# Altium schematic sheet 08 RAM.SchDoc
size 420 x 297 mm; Address1: Address1; Address2: Address2; Address3: Address3; Address4: Address4; DocumentNumber: АБВГ.123456.001 Э3; SheetNumber: 8; SheetTotal: 23; Scale: 1:1; DocumentType: Схема электрическая принципиальная; FirstReferrence: АБВГ.123456.001
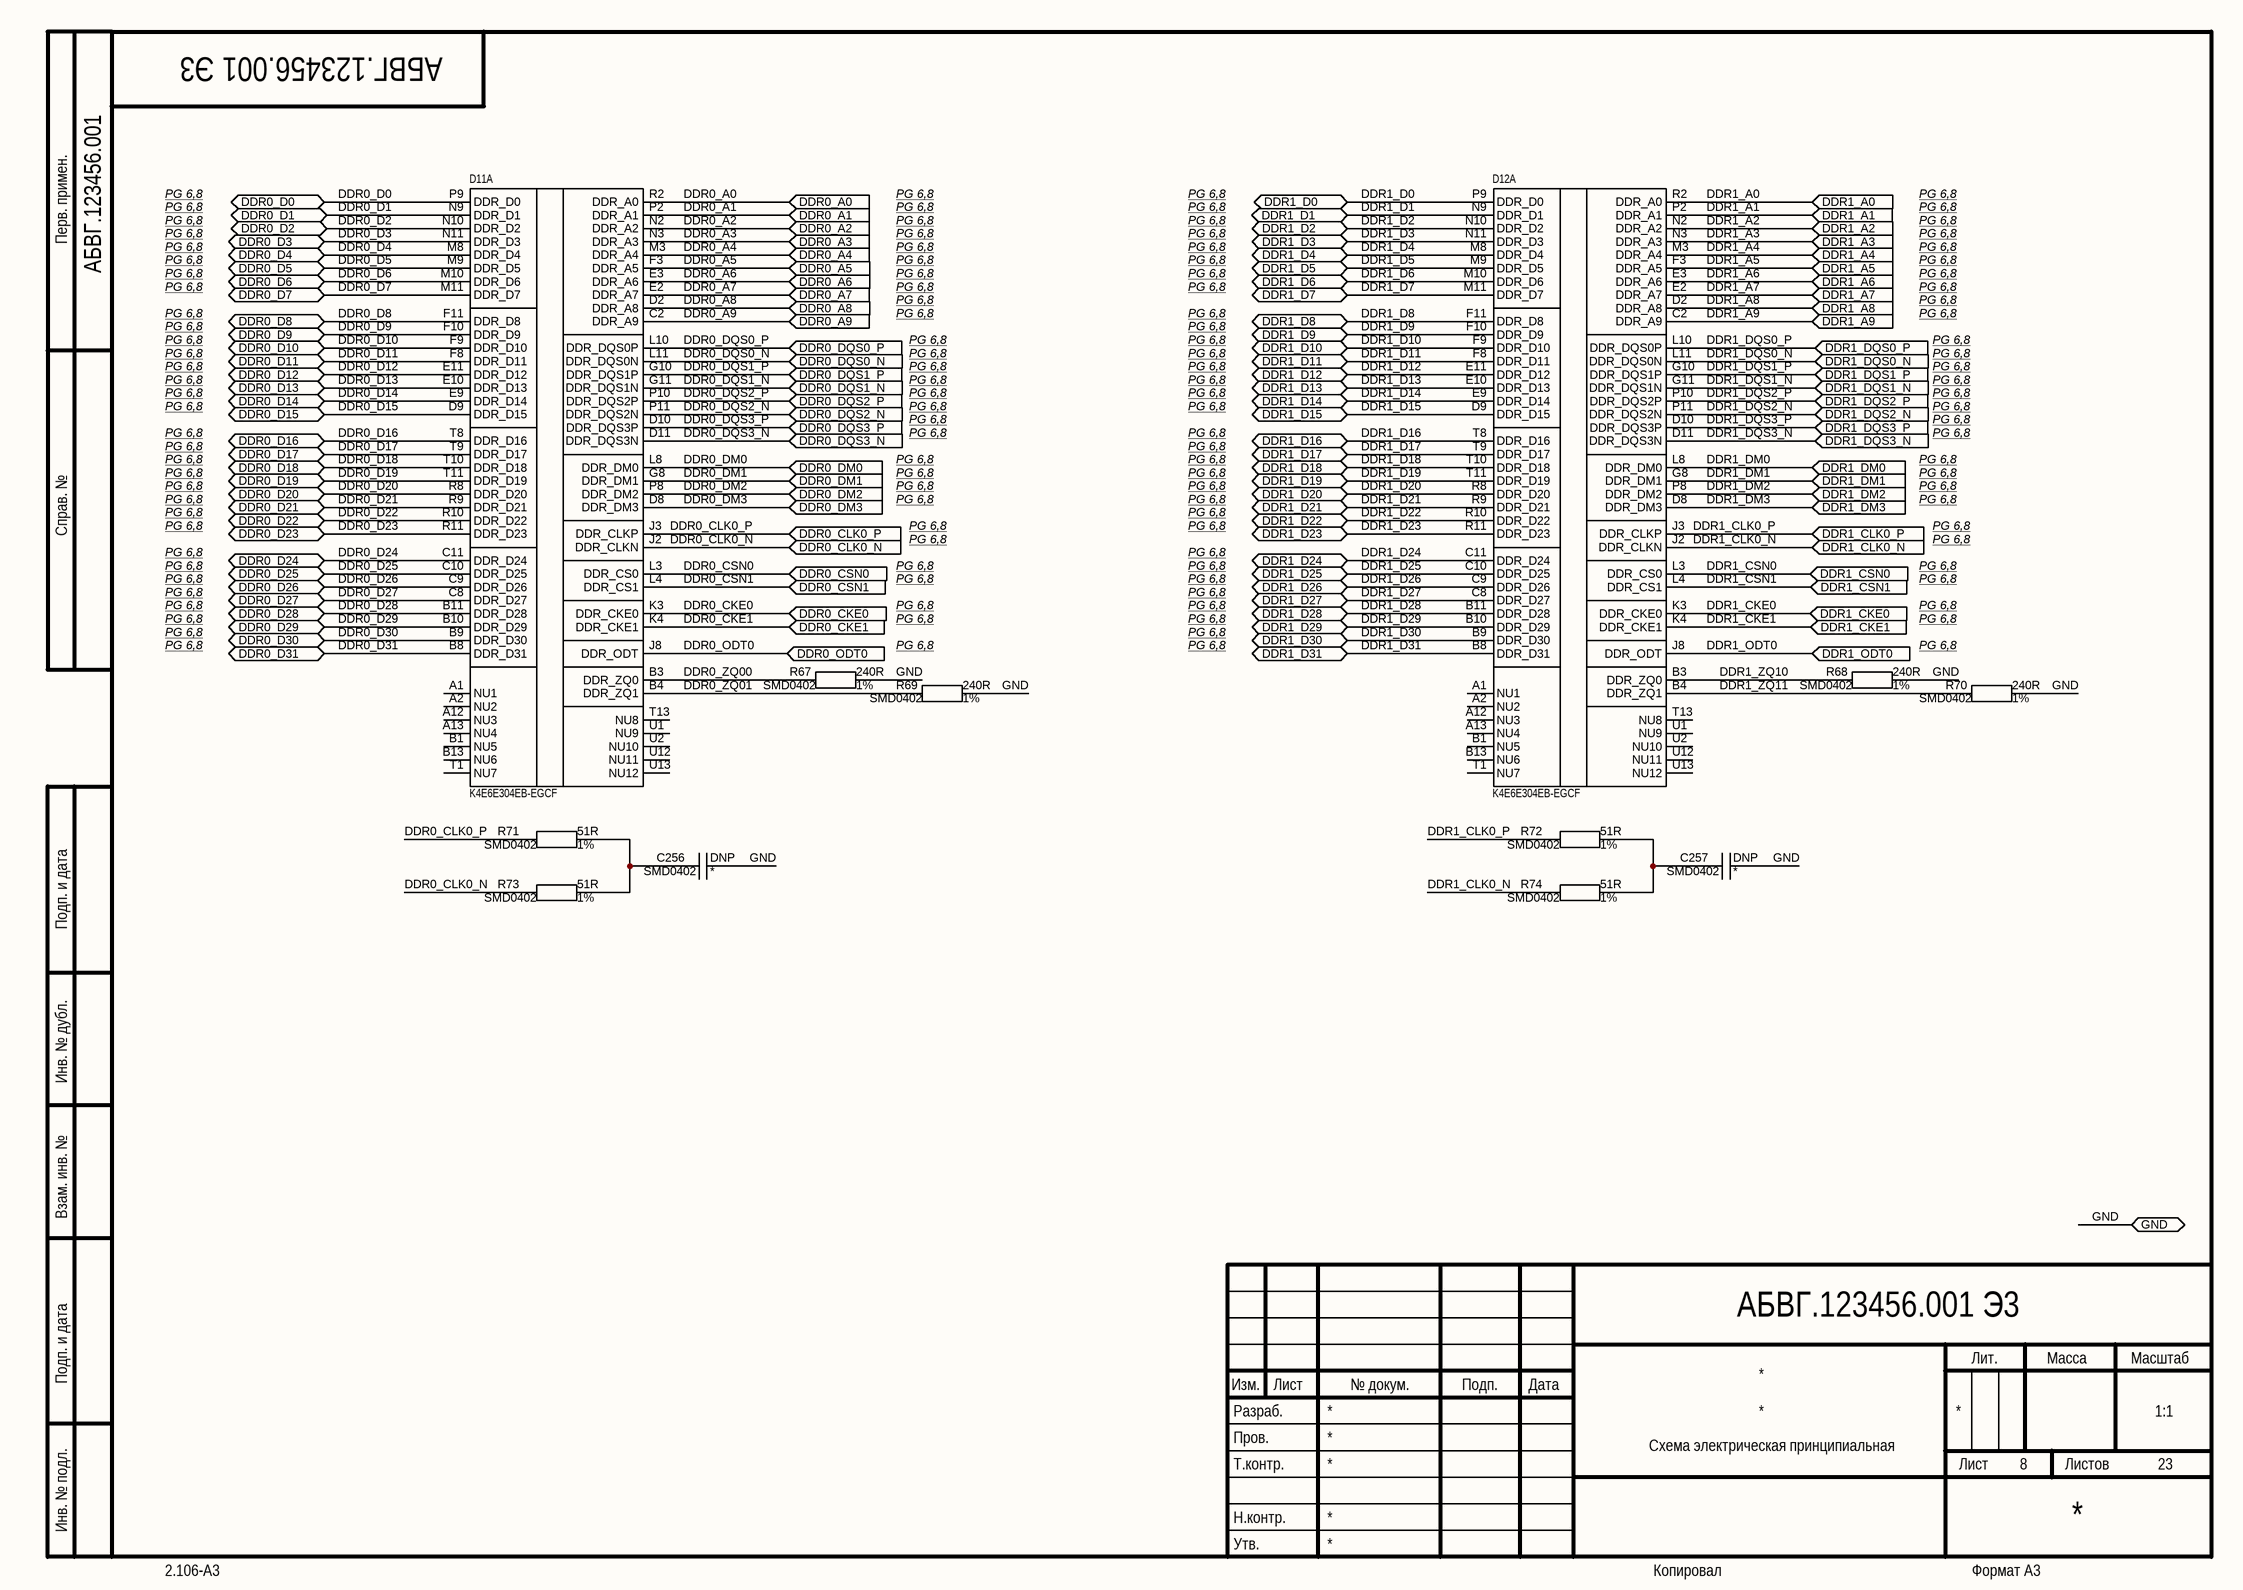
[diagram p0: 08 RAM.SchDoc]

## Parts
C256  Package: SMD0402  [CAP_SMD_0402_small]  (hidden comment: DNP)
C257  Package: SMD0402  [CAP_SMD_0402_small]  (hidden comment: DNP)
D11  K4E6E304EB-EGCF  [FBGA178_13R00X11R50X1R20]  (part A of 2)
D12  K4E6E304EB-EGCF  [FBGA178_13R00X11R50X1R20]  (part A of 2)
R67  Package: SMD0402  Tolerance: 1%  [RES_SMD_0402_SMALL]  (hidden comment: 240R)
R68  Package: SMD0402  Tolerance: 1%  [RES_SMD_0402_SMALL]  (hidden comment: 240R)
R69  Package: SMD0402  Tolerance: 1%  [RES_SMD_0402_SMALL]  (hidden comment: 240R)
R70  Package: SMD0402  Tolerance: 1%  [RES_SMD_0402_SMALL]  (hidden comment: 240R)
R71  Package: SMD0402  Tolerance: 1%  [RES_SMD_0402_SMALL]  (hidden comment: 51R)
R72  Package: SMD0402  Tolerance: 1%  [RES_SMD_0402_SMALL]  (hidden comment: 51R)
R73  Package: SMD0402  Tolerance: 1%  [RES_SMD_0402_SMALL]  (hidden comment: 51R)
R74  Package: SMD0402  Tolerance: 1%  [RES_SMD_0402_SMALL]  (hidden comment: 51R)

## Ports
DDR0_A0 (in), DDR0_A1 (in), DDR0_A2 (in), DDR0_A3 (in), DDR0_A4 (in), DDR0_A5 (in), DDR0_A6 (in), DDR0_A7 (in), DDR0_A8 (in), DDR0_A9 (in), DDR0_CKE0 (in), DDR0_CKE1 (in), DDR0_CLK0_N (in), DDR0_CLK0_P (in), DDR0_CSN0 (in), DDR0_CSN1 (in), DDR0_D0 (bidir), DDR0_D1 (bidir), DDR0_D2 (bidir), DDR0_D3 (bidir), DDR0_D4 (bidir), DDR0_D5 (bidir), DDR0_D6 (bidir), DDR0_D7 (bidir), DDR0_D8 (bidir), DDR0_D9 (bidir), DDR0_D10 (bidir), DDR0_D11 (bidir), DDR0_D12 (bidir), DDR0_D13 (bidir), DDR0_D14 (bidir), DDR0_D15 (bidir), DDR0_D16 (bidir), DDR0_D17 (bidir), DDR0_D18 (bidir), DDR0_D19 (bidir), DDR0_D20 (bidir), DDR0_D21 (bidir), DDR0_D22 (bidir), DDR0_D23 (bidir), DDR0_D24 (bidir), DDR0_D25 (bidir), DDR0_D26 (bidir), DDR0_D27 (bidir), DDR0_D28 (bidir), DDR0_D29 (bidir), DDR0_D30 (bidir), DDR0_D31 (bidir), DDR0_DM0 (in), DDR0_DM1 (in), DDR0_DM2 (in), DDR0_DM3 (in), DDR0_DQS0_N (in), DDR0_DQS0_P (in), DDR0_DQS1_N (in), DDR0_DQS1_P (in), DDR0_DQS2_N (in), DDR0_DQS2_P (in), DDR0_DQS3_N (in), DDR0_DQS3_P (in), DDR0_ODT0 (in), DDR1_A0 (in), DDR1_A1 (in), DDR1_A2 (in), DDR1_A3 (in), DDR1_A4 (in), DDR1_A5 (in), DDR1_A6 (in), DDR1_A7 (in), DDR1_A8 (in), DDR1_A9 (in), DDR1_CKE0 (in), DDR1_CKE1 (in), DDR1_CLK0_N (in), DDR1_CLK0_P (in), DDR1_CSN0 (in), DDR1_CSN1 (in), DDR1_D0 (bidir), DDR1_D1 (bidir), DDR1_D2 (bidir), DDR1_D3 (bidir), DDR1_D4 (bidir), DDR1_D5 (bidir), DDR1_D6 (bidir), DDR1_D7 (bidir), DDR1_D8 (bidir), DDR1_D9 (bidir), DDR1_D10 (bidir), DDR1_D11 (bidir), DDR1_D12 (bidir), DDR1_D13 (bidir), DDR1_D14 (bidir), DDR1_D15 (bidir), DDR1_D16 (bidir), DDR1_D17 (bidir), DDR1_D18 (bidir), DDR1_D19 (bidir), DDR1_D20 (bidir), DDR1_D21 (bidir), DDR1_D22 (bidir), DDR1_D23 (bidir), DDR1_D24 (bidir), DDR1_D25 (bidir), DDR1_D26 (bidir), DDR1_D27 (bidir), DDR1_D28 (bidir), DDR1_D29 (bidir), DDR1_D30 (bidir), DDR1_D31 (bidir), DDR1_DM0 (in), DDR1_DM1 (in), DDR1_DM2 (in), DDR1_DM3 (in), DDR1_DQS0_N (in), DDR1_DQS0_P (in), DDR1_DQS1_N (in), DDR1_DQS1_P (in), DDR1_DQS2_N (in), DDR1_DQS2_P (in), DDR1_DQS3_N (in), DDR1_DQS3_P (in), DDR1_ODT0 (in), GND (bidir)

## Nets
DDR0_A0: D11.R2(DDR_A0) ; port DDR0_A0
DDR0_A1: D11.P2(DDR_A1) ; port DDR0_A1
DDR0_A2: D11.N2(DDR_A2) ; port DDR0_A2
DDR0_A3: D11.N3(DDR_A3) ; port DDR0_A3
DDR0_A4: D11.M3(DDR_A4) ; port DDR0_A4
DDR0_A5: D11.F3(DDR_A5) ; port DDR0_A5
DDR0_A6: D11.E3(DDR_A6) ; port DDR0_A6
DDR0_A7: D11.E2(DDR_A7) ; port DDR0_A7
DDR0_A8: D11.D2(DDR_A8) ; port DDR0_A8
DDR0_A9: D11.C2(DDR_A9) ; port DDR0_A9
DDR0_CKE0: D11.K3(DDR_CKE0) ; port DDR0_CKE0
DDR0_CKE1: D11.K4(DDR_CKE1) ; port DDR0_CKE1
DDR0_CLK0_N: D11.J2(DDR_CLKN) R73.2 ; port DDR0_CLK0_N
DDR0_CLK0_P: D11.J3(DDR_CLKP) R71.2 ; port DDR0_CLK0_P
DDR0_CSN0: D11.L3(DDR_CS0) ; port DDR0_CSN0
DDR0_CSN1: D11.L4(DDR_CS1) ; port DDR0_CSN1
DDR0_D0: D11.P9(DDR_D0) ; port DDR0_D0
DDR0_D1: D11.N9(DDR_D1) ; port DDR0_D1
DDR0_D2: D11.N10(DDR_D2) ; port DDR0_D2
DDR0_D3: D11.N11(DDR_D3) ; port DDR0_D3
DDR0_D4: D11.M8(DDR_D4) ; port DDR0_D4
DDR0_D5: D11.M9(DDR_D5) ; port DDR0_D5
DDR0_D6: D11.M10(DDR_D6) ; port DDR0_D6
DDR0_D7: D11.M11(DDR_D7) ; port DDR0_D7
DDR0_D8: D11.F11(DDR_D8) ; port DDR0_D8
DDR0_D9: D11.F10(DDR_D9) ; port DDR0_D9
DDR0_D10: D11.F9(DDR_D10) ; port DDR0_D10
DDR0_D11: D11.F8(DDR_D11) ; port DDR0_D11
DDR0_D12: D11.E11(DDR_D12) ; port DDR0_D12
DDR0_D13: D11.E10(DDR_D13) ; port DDR0_D13
DDR0_D14: D11.E9(DDR_D14) ; port DDR0_D14
DDR0_D15: D11.D9(DDR_D15) ; port DDR0_D15
DDR0_D16: D11.T8(DDR_D16) ; port DDR0_D16
DDR0_D17: D11.T9(DDR_D17) ; port DDR0_D17
DDR0_D18: D11.T10(DDR_D18) ; port DDR0_D18
DDR0_D19: D11.T11(DDR_D19) ; port DDR0_D19
DDR0_D20: D11.R8(DDR_D20) ; port DDR0_D20
DDR0_D21: D11.R9(DDR_D21) ; port DDR0_D21
DDR0_D22: D11.R10(DDR_D22) ; port DDR0_D22
DDR0_D23: D11.R11(DDR_D23) ; port DDR0_D23
DDR0_D24: D11.C11(DDR_D24) ; port DDR0_D24
DDR0_D25: D11.C10(DDR_D25) ; port DDR0_D25
DDR0_D26: D11.C9(DDR_D26) ; port DDR0_D26
DDR0_D27: D11.C8(DDR_D27) ; port DDR0_D27
DDR0_D28: D11.B11(DDR_D28) ; port DDR0_D28
DDR0_D29: D11.B10(DDR_D29) ; port DDR0_D29
DDR0_D30: D11.B9(DDR_D30) ; port DDR0_D30
DDR0_D31: D11.B8(DDR_D31) ; port DDR0_D31
DDR0_DM0: D11.L8(DDR_DM0) ; port DDR0_DM0
DDR0_DM1: D11.G8(DDR_DM1) ; port DDR0_DM1
DDR0_DM2: D11.P8(DDR_DM2) ; port DDR0_DM2
DDR0_DM3: D11.D8(DDR_DM3) ; port DDR0_DM3
DDR0_DQS0_N: D11.L11(DDR_DQS0N) ; port DDR0_DQS0_N
DDR0_DQS0_P: D11.L10(DDR_DQS0P) ; port DDR0_DQS0_P
DDR0_DQS1_N: D11.G11(DDR_DQS1N) ; port DDR0_DQS1_N
DDR0_DQS1_P: D11.G10(DDR_DQS1P) ; port DDR0_DQS1_P
DDR0_DQS2_N: D11.P11(DDR_DQS2N) ; port DDR0_DQS2_N
DDR0_DQS2_P: D11.P10(DDR_DQS2P) ; port DDR0_DQS2_P
DDR0_DQS3_N: D11.D11(DDR_DQS3N) ; port DDR0_DQS3_N
DDR0_DQS3_P: D11.D10(DDR_DQS3P) ; port DDR0_DQS3_P
DDR0_ODT0: D11.J8(DDR_ODT) ; port DDR0_ODT0
DDR0_ZQ00: D11.B3(DDR_ZQ0) R67.2
DDR0_ZQ01: D11.B4(DDR_ZQ1) R69.2
DDR1_A0: D12.R2(DDR_A0) ; port DDR1_A0
DDR1_A1: D12.P2(DDR_A1) ; port DDR1_A1
DDR1_A2: D12.N2(DDR_A2) ; port DDR1_A2
DDR1_A3: D12.N3(DDR_A3) ; port DDR1_A3
DDR1_A4: D12.M3(DDR_A4) ; port DDR1_A4
DDR1_A5: D12.F3(DDR_A5) ; port DDR1_A5
DDR1_A6: D12.E3(DDR_A6) ; port DDR1_A6
DDR1_A7: D12.E2(DDR_A7) ; port DDR1_A7
DDR1_A8: D12.D2(DDR_A8) ; port DDR1_A8
DDR1_A9: D12.C2(DDR_A9) ; port DDR1_A9
DDR1_CKE0: D12.K3(DDR_CKE0) ; port DDR1_CKE0
DDR1_CKE1: D12.K4(DDR_CKE1) ; port DDR1_CKE1
DDR1_CLK0_N: D12.J2(DDR_CLKN) R74.2 ; port DDR1_CLK0_N
DDR1_CLK0_P: D12.J3(DDR_CLKP) R72.2 ; port DDR1_CLK0_P
DDR1_CSN0: D12.L3(DDR_CS0) ; port DDR1_CSN0
DDR1_CSN1: D12.L4(DDR_CS1) ; port DDR1_CSN1
DDR1_D0: D12.P9(DDR_D0) ; port DDR1_D0
DDR1_D1: D12.N9(DDR_D1) ; port DDR1_D1
DDR1_D2: D12.N10(DDR_D2) ; port DDR1_D2
DDR1_D3: D12.N11(DDR_D3) ; port DDR1_D3
DDR1_D4: D12.M8(DDR_D4) ; port DDR1_D4
DDR1_D5: D12.M9(DDR_D5) ; port DDR1_D5
DDR1_D6: D12.M10(DDR_D6) ; port DDR1_D6
DDR1_D7: D12.M11(DDR_D7) ; port DDR1_D7
DDR1_D8: D12.F11(DDR_D8) ; port DDR1_D8
DDR1_D9: D12.F10(DDR_D9) ; port DDR1_D9
DDR1_D10: D12.F9(DDR_D10) ; port DDR1_D10
DDR1_D11: D12.F8(DDR_D11) ; port DDR1_D11
DDR1_D12: D12.E11(DDR_D12) ; port DDR1_D12
DDR1_D13: D12.E10(DDR_D13) ; port DDR1_D13
DDR1_D14: D12.E9(DDR_D14) ; port DDR1_D14
DDR1_D15: D12.D9(DDR_D15) ; port DDR1_D15
DDR1_D16: D12.T8(DDR_D16) ; port DDR1_D16
DDR1_D17: D12.T9(DDR_D17) ; port DDR1_D17
DDR1_D18: D12.T10(DDR_D18) ; port DDR1_D18
DDR1_D19: D12.T11(DDR_D19) ; port DDR1_D19
DDR1_D20: D12.R8(DDR_D20) ; port DDR1_D20
DDR1_D21: D12.R9(DDR_D21) ; port DDR1_D21
DDR1_D22: D12.R10(DDR_D22) ; port DDR1_D22
DDR1_D23: D12.R11(DDR_D23) ; port DDR1_D23
DDR1_D24: D12.C11(DDR_D24) ; port DDR1_D24
DDR1_D25: D12.C10(DDR_D25) ; port DDR1_D25
DDR1_D26: D12.C9(DDR_D26) ; port DDR1_D26
DDR1_D27: D12.C8(DDR_D27) ; port DDR1_D27
DDR1_D28: D12.B11(DDR_D28) ; port DDR1_D28
DDR1_D29: D12.B10(DDR_D29) ; port DDR1_D29
DDR1_D30: D12.B9(DDR_D30) ; port DDR1_D30
DDR1_D31: D12.B8(DDR_D31) ; port DDR1_D31
DDR1_DM0: D12.L8(DDR_DM0) ; port DDR1_DM0
DDR1_DM1: D12.G8(DDR_DM1) ; port DDR1_DM1
DDR1_DM2: D12.P8(DDR_DM2) ; port DDR1_DM2
DDR1_DM3: D12.D8(DDR_DM3) ; port DDR1_DM3
DDR1_DQS0_N: D12.L11(DDR_DQS0N) ; port DDR1_DQS0_N
DDR1_DQS0_P: D12.L10(DDR_DQS0P) ; port DDR1_DQS0_P
DDR1_DQS1_N: D12.G11(DDR_DQS1N) ; port DDR1_DQS1_N
DDR1_DQS1_P: D12.G10(DDR_DQS1P) ; port DDR1_DQS1_P
DDR1_DQS2_N: D12.P11(DDR_DQS2N) ; port DDR1_DQS2_N
DDR1_DQS2_P: D12.P10(DDR_DQS2P) ; port DDR1_DQS2_P
DDR1_DQS3_N: D12.D11(DDR_DQS3N) ; port DDR1_DQS3_N
DDR1_DQS3_P: D12.D10(DDR_DQS3P) ; port DDR1_DQS3_P
DDR1_ODT0: D12.J8(DDR_ODT) ; port DDR1_ODT0
DDR1_ZQ10: D12.B3(DDR_ZQ0) R68.2
DDR1_ZQ11: D12.B4(DDR_ZQ1) R70.2
GND: C256.1 C257.1 R67.1 R68.1 R69.1 R70.1 ; port GND
NetC256_2: C256.2 R71.1 R73.1
NetC257_2: C257.2 R72.1 R74.1

Not connected (* = marked no-connect by the designer): D11 A1(NU1) A2(NU2) A12(NU3) A13(NU4) B1(NU5) B13(NU6) T1(NU7) T13(NU8) U1(NU9) U2(NU10) U12(NU11) U13(NU12); D12 A1(NU1) A2(NU2) A12(NU3) A13(NU4) B1(NU5) B13(NU6) T1(NU7) T13(NU8) U1(NU9) U2(NU10) U12(NU11) U13(NU12)

## Notes on the sheet
- Перв. примен.
- PG 6,8
- Справ. №
- Подп. и дата
- Инв. № дубл.
- Взам. инв. №
- Разраб.
- Изм.
- Лист
- № докум.
- Подп.
- Дата
- Лит.
- Масса
- Масштаб
- Пров.
- Т.контр.
- Листов
- Инв. № подл.
- Утв.
- Н.контр.
- 2.106-A3
- Копировал
- Формат А3

## Library data of the parts
C256 C257 = Ceramic_Cap: PartNumber: Do Not Place; ComponentType: SMD Ceramic Chip Capacitor; Manufacter: *; Tolerance: *; ClassName: Solder_Clearence; Value: DNP; Voltage: *
D11 D12 = K4E8E304EE-EGCE: ComponentType: *; Manufacter: *; Package: FBGA178; PartNumber: K4E6E304EB-EGCF; ClassName: *; Value: K4E6E304EB-EGCF
R67-R70 = Chip_Res: PartNumber: RC0402FR-07240RL; ComponentType: SMD Chip Resistor; Manufacter: *; Voltage: *; ClassName: Solder_Clearence; Value: 240R
R71-R74 = Chip_Res: PartNumber: RC0402FR-0751RL; ComponentType: SMD Chip Resistor; Manufacter: *; Voltage: *; ClassName: Solder_Clearence; Value: 51R